# Altium schematic sheet [2]STM32L4.SchDoc
size A4; SheetNumber: 2; SheetTotal: 6
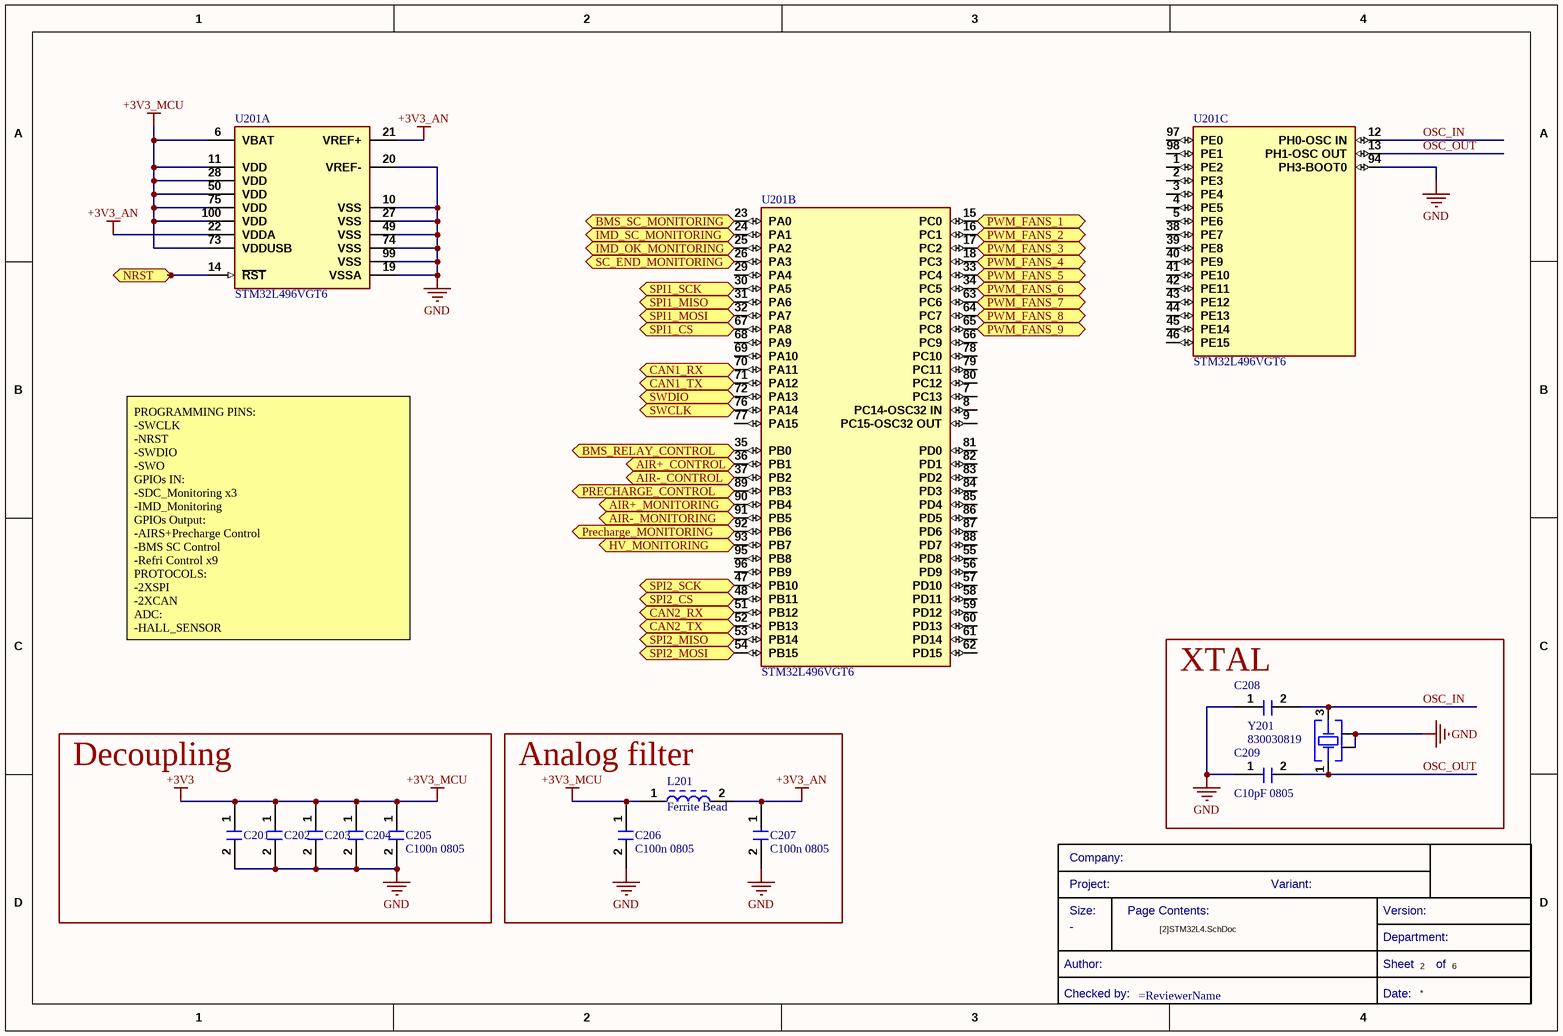
[diagram p0: [2]STM32L4.SchDoc]

## Parts
?  (no value)  (graphical)
C201  C100n 0805  [C0805FNPC-R]  (value not drawn)
C202  C100n 0805  [C0805FNPC-R]  (value not drawn)
C203  C100n 0805  [C0805FNPC-R]  (value not drawn)
C204  C100n 0805  [C0805FNPC-R]  (value not drawn)
C205  C100n 0805  [C0805FNPC-R]
C206  C100n 0805  [C0805FNPC-R]
C207  C100n 0805  [C0805FNPC-R]
C208  C10pF 0805  [WCAP-CSGP_0805_L2W1.25H0.6_Reflow]
C209  C10pF 0805  [WCAP-CSGP_0805_L2W1.25H0.6_Reflow]  (value not drawn)
L201  Ferrite Bead  [L_Ferrite_bead_0805]
U201  STM32L496VGT6  [FP-LQFP100-1L-IPC_A]  (parts A,B,C of 3)
Y201  830030819  [WE-XTAL_CFPX-104]

## Blocks framed on the sheet
XTAL: C208 C209 Y201
Decoupling: C201-C205
Analog filter: C206 C207 L201

## Ports
AIR+_CONTROL (bidir, see Master_uC_PCB.SchDoc[1B]), AIR+_MONITORING (bidir, see Master_uC_PCB.SchDoc[1A]), AIR-_CONTROL (bidir, see Master_uC_PCB.SchDoc[1B]), AIR-_MONITORING (bidir, see Master_uC_PCB.SchDoc[1A]), BMS_RELAY_CONTROL (bidir, see Master_uC_PCB.SchDoc[1A]), BMS_SC_MONITORING (bidir, see Master_uC_PCB.SchDoc[1A]), CAN1_RX (bidir, see Master_uC_PCB.SchDoc[2A], [3]CAN_Communication[1A]), CAN1_TX (bidir, see Master_uC_PCB.SchDoc[2A], [3]CAN_Communication[1B]), CAN2_RX (bidir, see Master_uC_PCB.SchDoc[2A], [3]CAN_Communication[1A]), CAN2_TX (bidir, see Master_uC_PCB.SchDoc[2A], [3]CAN_Communication[1A]), HV_MONITORING (bidir, see Master_uC_PCB.SchDoc[1A]), IMD_OK_MONITORING (bidir, see Master_uC_PCB.SchDoc[1A]), IMD_SC_MONITORING (bidir, see Master_uC_PCB.SchDoc[1A]), NRST (bidir, see Master_uC_PCB.SchDoc[2B]), PRECHARGE_CONTROL (bidir, see Master_uC_PCB.SchDoc[1B]), Precharge_MONITORING (bidir, see Master_uC_PCB.SchDoc[1A]), PWM_FANS_1 (bidir, see Master_uC_PCB.SchDoc[1B], [5]Cooling_Control[4A]), PWM_FANS_2 (bidir, see Master_uC_PCB.SchDoc[1B], [5]Cooling_Control[4A]), PWM_FANS_3 (bidir, see Master_uC_PCB.SchDoc[1B], [5]Cooling_Control[4A]), PWM_FANS_4 (bidir, see Master_uC_PCB.SchDoc[1B], [5]Cooling_Control[4A]), PWM_FANS_5 (bidir, see Master_uC_PCB.SchDoc[1B], [5]Cooling_Control[4B]), PWM_FANS_6 (bidir, see Master_uC_PCB.SchDoc[1B], [5]Cooling_Control[4B]), PWM_FANS_7 (bidir, see Master_uC_PCB.SchDoc[1B], [5]Cooling_Control[4B]), PWM_FANS_8 (bidir, see Master_uC_PCB.SchDoc[1B], [5]Cooling_Control[4B]), PWM_FANS_9 (bidir, see Master_uC_PCB.SchDoc[1B], [5]Cooling_Control[4B]), SC_END_MONITORING (bidir, see Master_uC_PCB.SchDoc[1A]), SPI1_CS (bidir, see Master_uC_PCB.SchDoc[2A], [4]isoSPI[1A]), SPI1_MISO (bidir, see Master_uC_PCB.SchDoc[2A], [4]isoSPI[1A]), SPI1_MOSI (bidir, see Master_uC_PCB.SchDoc[2A], [4]isoSPI[1A]), SPI1_SCK (bidir, see Master_uC_PCB.SchDoc[2A], [4]isoSPI[1A]), SPI2_CS (bidir, see Master_uC_PCB.SchDoc[2B], [4]isoSPI[1B]), SPI2_MISO (bidir, see Master_uC_PCB.SchDoc[2B], [4]isoSPI[1B]), SPI2_MOSI (bidir, see Master_uC_PCB.SchDoc[2B], [4]isoSPI[1B]), SPI2_SCK (bidir, see Master_uC_PCB.SchDoc[2A], [4]isoSPI[1A]), SWCLK (bidir, see Master_uC_PCB.SchDoc[2B]), SWDIO (bidir, see Master_uC_PCB.SchDoc[2B])

## Nets
+3V3: C201.1 C202.1 C203.1 C204.1 C205.1 C206.1 L201.1 U201.6(VBAT) U201.11(VDD) U201.28(VDD) U201.50(VDD) U201.73(VDDUSB) U201.75(VDD) U201.100(VDD)  [also labelled +3V3_MCU]
+3V3_AN: C207.1 L201.2 U201.21(VREF+) U201.22(VDDA)
GND: C201.2 C202.2 C203.2 C204.2 C205.2 C206.2 C207.2 C208.1 C209.1 U201.10(VSS) U201.19(VSSA) U201.20(VREF-) U201.27(VSS) U201.49(VSS) U201.74(VSS) U201.94(PH3-BOOT0) U201.99(VSS) Y201.2(GND_&_Lid) Y201.4(GND_&_Lid)
AIR+_CONTROL: U201.36(PB1) ; port AIR+_CONTROL
AIR+_MONITORING: U201.90(PB4) ; port AIR+_MONITORING
AIR-_CONTROL: U201.37(PB2) ; port AIR-_CONTROL
AIR-_MONITORING: U201.91(PB5) ; port AIR-_MONITORING
BMS_RELAY_CONTROL: U201.35(PB0) ; port BMS_RELAY_CONTROL
BMS_SC_MONITORING: U201.23(PA0) ; port BMS_SC_MONITORING
CAN1_RX: U201.70(PA11) ; port CAN1_RX
CAN1_TX: U201.71(PA12) ; port CAN1_TX
CAN2_RX: U201.51(PB12) ; port CAN2_RX
CAN2_TX: U201.52(PB13) ; port CAN2_TX
HV_MONITORING: U201.93(PB7) ; port HV_MONITORING
IMD_OK_MONITORING: U201.25(PA2) ; port IMD_OK_MONITORING
IMD_SC_MONITORING: U201.24(PA1) ; port IMD_SC_MONITORING
NRST: U201.14(~{RST}) ; port NRST
OSC_IN: C208.2 U201.12(PH0-OSC_IN) Y201.3(Crystal)
OSC_OUT: C209.2 U201.13(PH1-OSC_OUT) Y201.1(Crystal)
PRECHARGE_CONTROL: U201.89(PB3) ; port PRECHARGE_CONTROL
Precharge_MONITORING: U201.92(PB6) ; port Precharge_MONITORING
PWM_FANS_1: U201.15(PC0) ; port PWM_FANS_1
PWM_FANS_2: U201.16(PC1) ; port PWM_FANS_2
PWM_FANS_3: U201.17(PC2) ; port PWM_FANS_3
PWM_FANS_4: U201.18(PC3) ; port PWM_FANS_4
PWM_FANS_5: U201.33(PC4) ; port PWM_FANS_5
PWM_FANS_6: U201.34(PC5) ; port PWM_FANS_6
PWM_FANS_7: U201.63(PC6) ; port PWM_FANS_7
PWM_FANS_8: U201.64(PC7) ; port PWM_FANS_8
PWM_FANS_9: U201.65(PC8) ; port PWM_FANS_9
SC_END_MONITORING: U201.26(PA3) ; port SC_END_MONITORING
SPI1_CS: U201.67(PA8) ; port SPI1_CS
SPI1_MISO: U201.31(PA6) ; port SPI1_MISO
SPI1_MOSI: U201.32(PA7) ; port SPI1_MOSI
SPI1_SCK: U201.30(PA5) ; port SPI1_SCK
SPI2_CS: U201.48(PB11) ; port SPI2_CS
SPI2_MISO: U201.53(PB14) ; port SPI2_MISO
SPI2_MOSI: U201.54(PB15) ; port SPI2_MOSI
SPI2_SCK: U201.47(PB10) ; port SPI2_SCK
SWCLK: U201.76(PA14) ; port SWCLK
SWDIO: U201.72(PA13) ; port SWDIO

Not connected (* = marked no-connect by the designer): U201 1(PE2) 2(PE3) 3(PE4) 4(PE5) 5(PE6) 7(PC13) 8(PC14-OSC32_IN) 9(PC15-OSC32_OUT) 29(PA4) 38(PE7) 39(PE8) 40(PE9) 41(PE10) 42(PE11) 43(PE12) 44(PE13) 45(PE14) 46(PE15) 55(PD8) 56(PD9) 57(PD10) 58(PD11) 59(PD12) 60(PD13) 61(PD14) 62(PD15) 66(PC9) 68(PA9) 69(PA10) 77(PA15) 78(PC10) 79(PC11) 80(PC12) 81(PD0) 82(PD1) 83(PD2) 84(PD3) 85(PD4) 86(PD5) 87(PD6) 88(PD7) 95(PB8) 96(PB9) 97(PE0) 98(PE1)

## Notes on the sheet
- PROGRAMMING PINS:
  -SWCLK
  -NRST
  -SWDIO
  -SWO
  GPIOs IN:
  -SDC_Monitoring x3
  -IMD_Monitoring
  GPIOs Output:
  -AIRS+Precharge Control
  -BMS SC Control
  -Refri Control x9
  PROTOCOLS:
  -2XSPI
  -2XCAN
  ADC:
  -HALL_SENSOR
- Size:
- Company:
- Project:
- Page Contents:
- Variant:
- Version:
- Checked by:
- Author:
- Sheet
- Date:
- Department:
- of

## Library data of the parts
? = CMP-00043-6: Standard Title Block
C201-C207 = CMP-00063-1: Cap, 0.1ΜF, 50V, 10%, X7R, 0805; Manufacturer 1: Wurth Electronics; Manufacturer Part Number 1: 885012207098; Value: 100nF; .Creator: DR; Pricing 1: 100=0,10200, 500=0,07100, 2000=0,06100 (GBP); ComponentLink1URL: http://www.farnell.com/datasheets/1958498.pdf?src-supplier=Farnell; Design Item ID: C100n-50V-0805FNPC-X7R; Voltage Rating (DC): 50V; Voltage Rating: 50V; Max Operating Temperature: 125°C; RoHS: Yes; Case Code (Metric): 2012; Mount: Surface Mount; REACH SVHC: Unknown; Stock 1: 8000; Source: Passives.SchLib; Tolerance: 10%; RoHS Compliant: Yes; Dielectric: X7R; ComponentLink2Description: http://www.farnell.com/datasheets/1958498.pdf?src-supplier=Element14; ComponentLink2URL: http://www.farnell.com/datasheets/1958498.pdf?src-supplier=Element14; Min Operating Temperature: -55°C; Width: 0.049inch; Category: Ceramic Capacitors; Thickness: 0.035inch; Length: 0.079inch; ComponentLink3URL: https://katalog.we-online.de/pbs/datasheet/885012207098.pdf?src-supplier=Digi-Key; Case/Package: 0805; ComponentLink3Description: https://katalog.we-online.de/pbs/datasheet/885012207098.pdf?src-supplier=Digi-Key; Packaging: Cut Tape; ComponentLink1Description: http://www.farnell.com/datasheets/1958498.pdf?src-supplier=Farnell; ComponentLink4Description: http://www.farnell.com/datasheets/1958498.pdf?src-supplier=Newark; ComponentLink4URL: http://www.farnell.com/datasheets/1958498.pdf?src-supplier=Newark
C208 C209 = CMP-001-00012-2: Ceramic Capacitor, Multilayer, Ceramic, 50V, 5% +Tol, 5% -Tol, C0G, 30ppm/Cel TC, 0.00001uF, Surface Mount, 0805. 885012007051; Pins: 2; RoHS Compliant: Yes; Capacitor Type: Ceramic
L201 = CMP-00166-1: Manufacturer Part Number: BLM18EG331TN1D; Manufacturer: Murata; .Creator: GP; Tolerance: 25%; Impedance: 330R; Max DC Current: 500mA; Resistance: 0.21; Number of Circuits: 1; DC Resistance (DCR): 210mR; Material: Ferrite,Steel; Test Frequency: 100MHz; RoHS: Yes; Case Code (Metric): 1608; ComponentLink6URL: https://datasheet.ciiva.com/3082/l0110s0101blm18e-3082714.pdf?src-supplier=Avnet; ComponentLink7URL: https://datasheet.ciiva.com/6211/l0110s0101blm18e-6211470.pdf?src-supplier=Digi-Key; Width: 0.8mm; ComponentLink6Description: https://datasheet.ciiva.com/3082/l0110s0101blm18e-3082714.pdf?src-supplier=Avnet; Series: BLM18E; Stock 1: 20037; Core Material: Ferrite; Packaging: Tape and Reel; Max Operating Temperature: 125°C; Case/Package: 0603; ComponentLink8URL: https://datasheet.ciiva.com/6211/l0110s0101blm18e-6211471.pdf?src-supplier=Digi-Key; Case Code (Imperial): 0603; Lead Free: Lead Free; ComponentLink3Description: https://datasheet.ciiva.com/41449/001172267-da-01-en-drossel-0603-330r-1-6x0-8mm-4000st-41449581.pdf?src-supplier=Conrad; Height: 0.8mm; REACH SVHC: No SVHC; ComponentLink1URL: https://datasheet.ciiva.com/1467/5169-1467232.pdf?src-supplier=Element14; Number of Pins: 2; Source: Filter components.SchLib; ComponentLink1Description: https://datasheet.ciiva.com/1467/5169-1467232.pdf?src-supplier=Element14; Depth: 0.8mm; Termination: SMD/SMT; Package Quantity: 1; Min Operating Temperature: -55°C; ComponentLink7Description: https://datasheet.ciiva.com/6211/l0110s0101blm18e-6211470.pdf?src-supplier=Digi-Key; Design Item ID: L_Ferrite_bead_782853561; Length: 1.6mm; ComponentLink4Description: https://datasheet.ciiva.com/1467/5169-1467233.pdf?src-supplier=Element14; ComponentLink8Description: https://datasheet.ciiva.com/6211/l0110s0101blm18e-6211471.pdf?src-supplier=Digi-Key; Current Rating: 500mA; RoHS Compliant: Yes; ComponentLink2Description: https://datasheet.ciiva.com/11795/0900766b811b5866-11795405.pdf?src-supplier=RSComponents; Number of Lines: 1; ComponentLink2URL: https://datasheet.ciiva.com/11795/0900766b811b5866-11795405.pdf?src-supplier=RSComponents; Pricing 1: 1=0,23000, 10=0,17500, 25=0,14520, 50=0,12520, 100=0,11260, 250=0,09508, 500=0,08508, 1000=0,07257 (USD); Max Current Rating: 500mA; ComponentLink5URL: https://datasheet.ciiva.com/1561/5169-1561345.pdf?src-supplier=Newark; ComponentLink4URL: https://datasheet.ciiva.com/1467/5169-1467233.pdf?src-supplier=Element14; Category: Ferrite Beads and Chips; ComponentLink3URL: https://datasheet.ciiva.com/41449/001172267-da-01-en-drossel-0603-330r-1-6x0-8mm-4000st-41449581.pdf?src-supplier=Conrad; ComponentLink5Description: https://datasheet.ciiva.com/1561/5169-1561345.pdf?src-supplier=Newark
U201 = CMP-031-00008-1: RISC Microcontroller, 32-Bit, FLASH, CORTEX-M4 CPU, 80MHz, CMOS, PQFP100; Max Supply Voltage: 3.6V; Min Supply Voltage: 1.71V; RoHS Compliant: Yes; Case/Package: LFQFP; Max Operating Temperature: 85°C; Pins: 100; Min Operating Temperature: -40°C
Y201 = CMP-003-00000-1: WE-XTAL Quartz Crystal, SMT, CFPX-104, 16MHz, +/-50ppm; Manufacturer: Wurth Elektronik; Load Capacitance: 18pF; ComponentLink2Description: Datasheet Link; Manufacturer Part Number: 830030819; Match Code: WE-XTAL; ComponentLink1Description: Website Link; Width: 3.2mm; Source: WE-XTAL.SchLib; Category: Crystals; Mount: Surface Mount; Frequency: 16MHz; Operating Temperature Max: 60°C; Frequency Tolerance: +/-50ppm; Pins: 4; Design Item ID: 830030819; Component Type: Standard; Length: 5mm; Height: 1mm; Frequency Stability: +/-50ppm; Operating Temperature Min: -10°C; ComponentLink2URL: https://www.we-online.com/redexpert/spec/830030819?ad; ComponentLink1URL: https://www.we-online.com/redexpert/article/830030819?ad; Packaging: Tape and Reel; Case/Package: CFPX-104